# Altium schematic sheet RGBM-04.SchDoc
size Tabloid; SheetNumber: 4; SheetTotal: 7
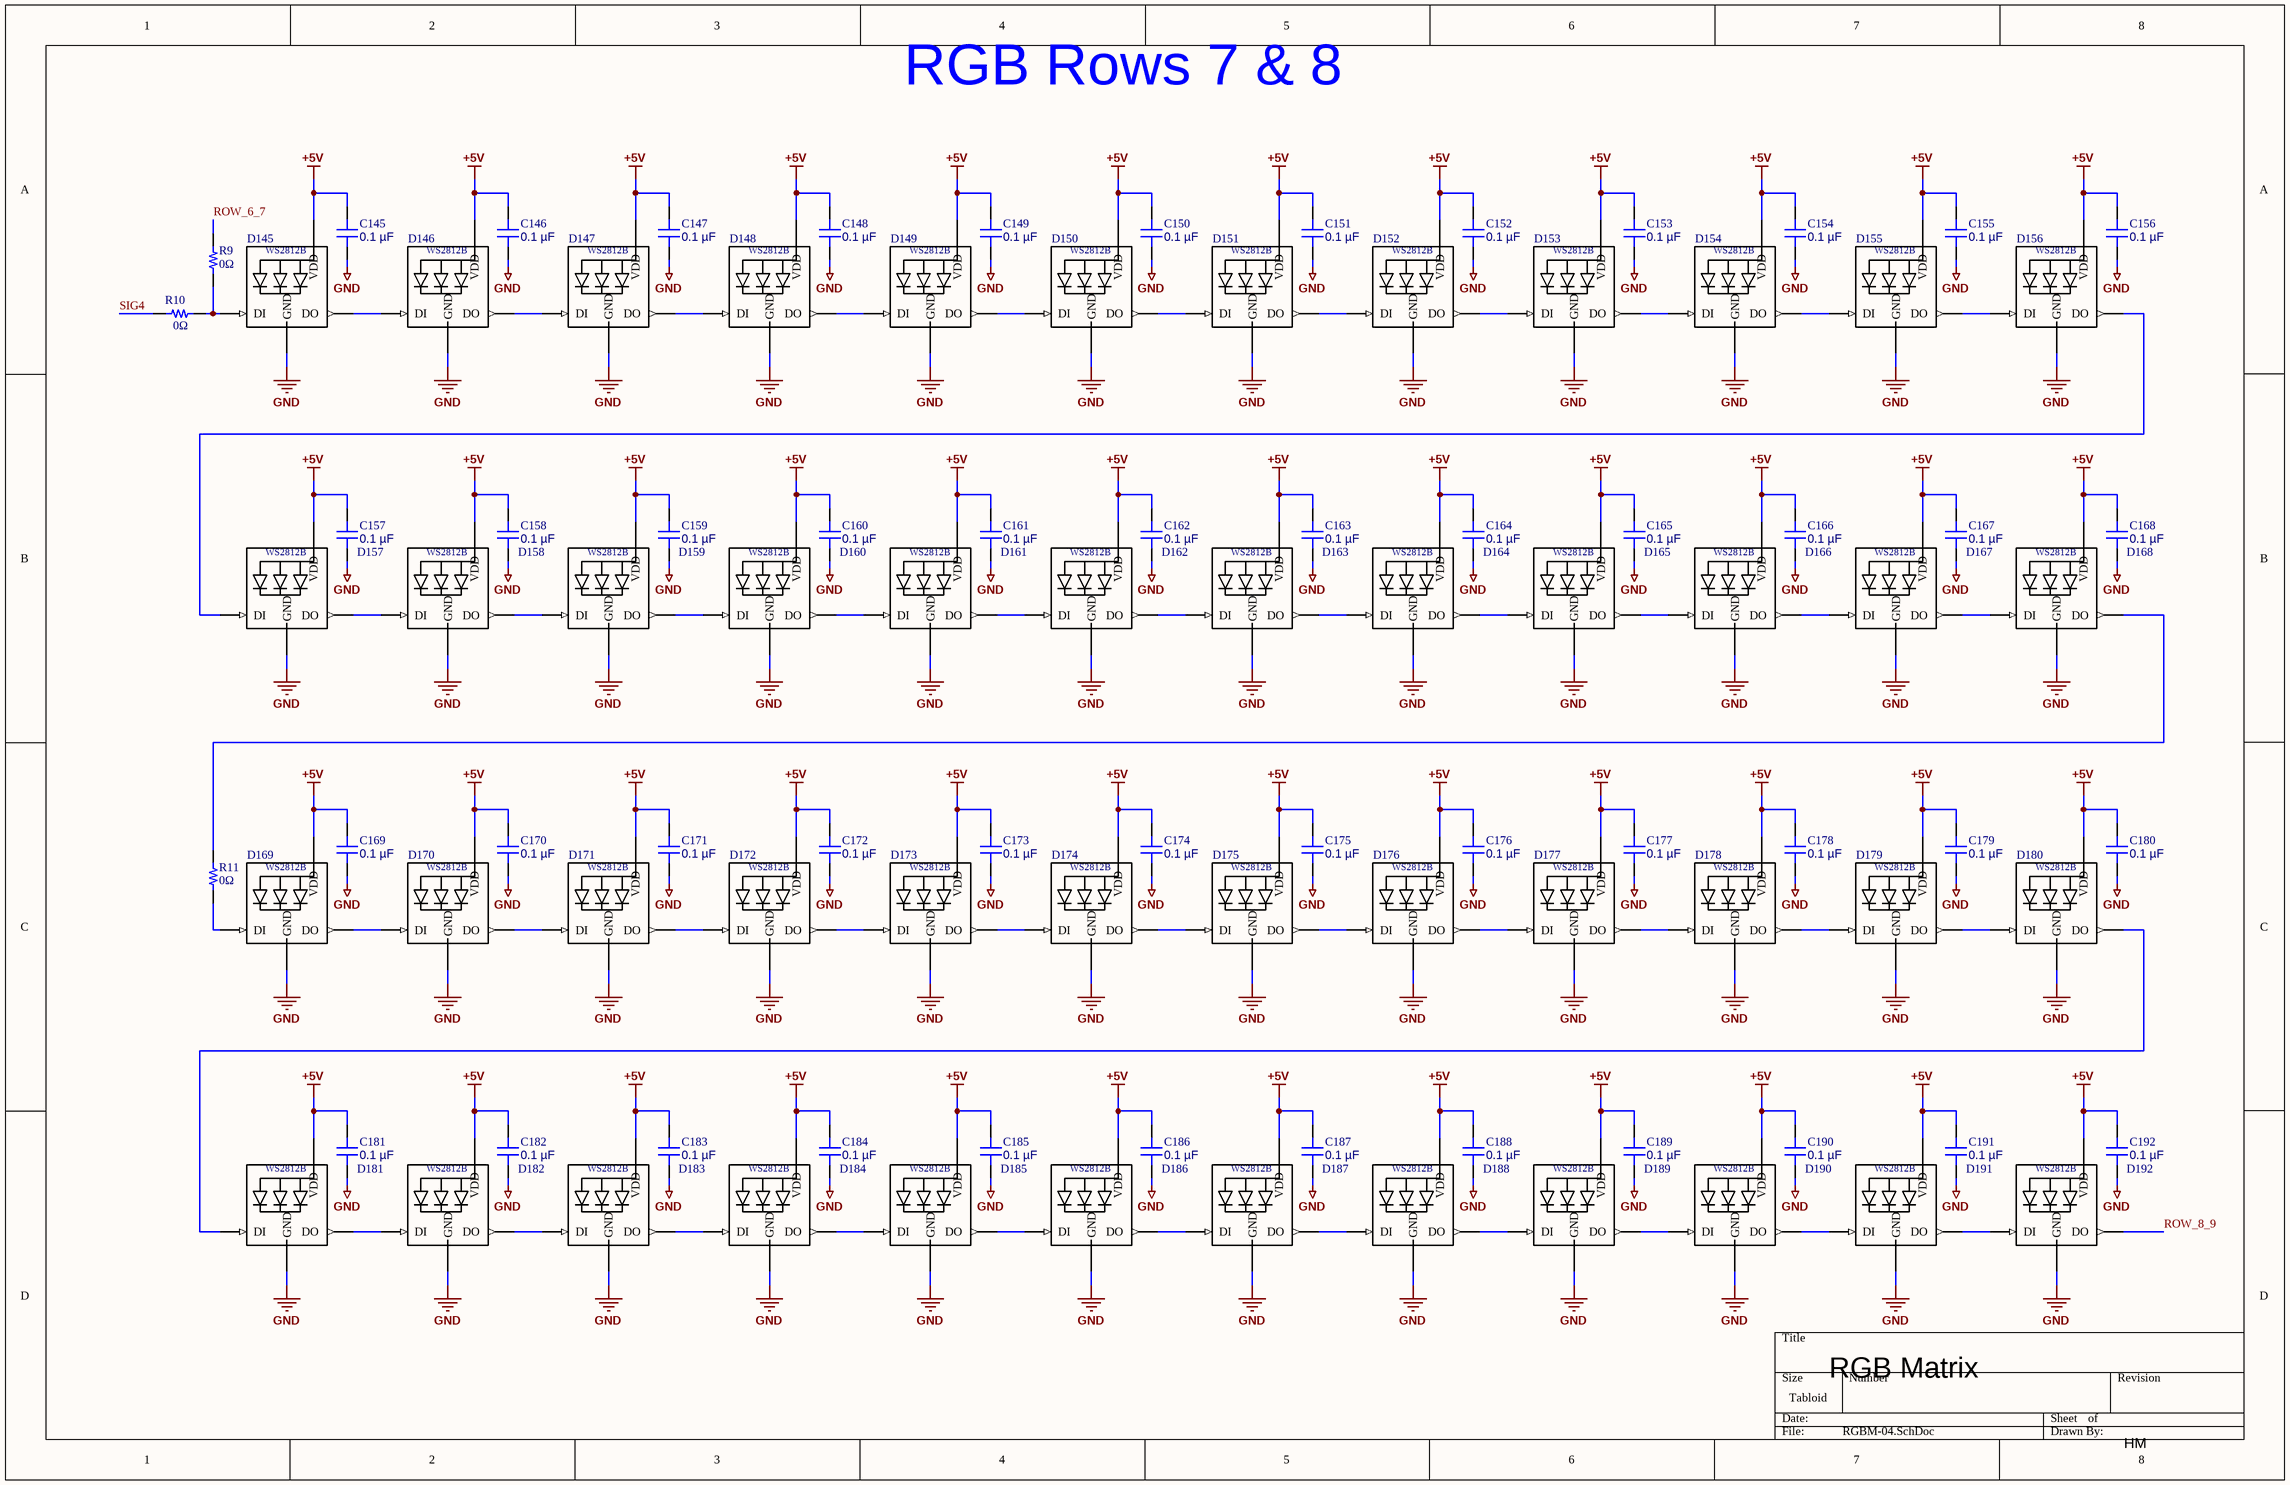
[diagram p0: RGBM-04.SchDoc]

## Parts
C145  0.1 µF  [CAP 0603_1608]
C146  0.1 µF  [CAP 0603_1608]
C147  0.1 µF  [CAP 0603_1608]
C148  0.1 µF  [CAP 0603_1608]
C149  0.1 µF  [CAP 0603_1608]
C150  0.1 µF  [CAP 0603_1608]
C151  0.1 µF  [CAP 0603_1608]
C152  0.1 µF  [CAP 0603_1608]
C153  0.1 µF  [CAP 0603_1608]
C154  0.1 µF  [CAP 0603_1608]
C155  0.1 µF  [CAP 0603_1608]
C156  0.1 µF  [CAP 0603_1608]
C157  0.1 µF  [CAP 0603_1608]
C158  0.1 µF  [CAP 0603_1608]
C159  0.1 µF  [CAP 0603_1608]
C160  0.1 µF  [CAP 0603_1608]
C161  0.1 µF  [CAP 0603_1608]
C162  0.1 µF  [CAP 0603_1608]
C163  0.1 µF  [CAP 0603_1608]
C164  0.1 µF  [CAP 0603_1608]
C165  0.1 µF  [CAP 0603_1608]
C166  0.1 µF  [CAP 0603_1608]
C167  0.1 µF  [CAP 0603_1608]
C168  0.1 µF  [CAP 0603_1608]
C169  0.1 µF  [CAP 0603_1608]
C170  0.1 µF  [CAP 0603_1608]
C171  0.1 µF  [CAP 0603_1608]
C172  0.1 µF  [CAP 0603_1608]
C173  0.1 µF  [CAP 0603_1608]
C174  0.1 µF  [CAP 0603_1608]
C175  0.1 µF  [CAP 0603_1608]
C176  0.1 µF  [CAP 0603_1608]
C177  0.1 µF  [CAP 0603_1608]
C178  0.1 µF  [CAP 0603_1608]
C179  0.1 µF  [CAP 0603_1608]
C180  0.1 µF  [CAP 0603_1608]
C181  0.1 µF  [CAP 0603_1608]
C182  0.1 µF  [CAP 0603_1608]
C183  0.1 µF  [CAP 0603_1608]
C184  0.1 µF  [CAP 0603_1608]
C185  0.1 µF  [CAP 0603_1608]
C186  0.1 µF  [CAP 0603_1608]
C187  0.1 µF  [CAP 0603_1608]
C188  0.1 µF  [CAP 0603_1608]
C189  0.1 µF  [CAP 0603_1608]
C190  0.1 µF  [CAP 0603_1608]
C191  0.1 µF  [CAP 0603_1608]
C192  0.1 µF  [CAP 0603_1608]
D145  WS2812B  [*WS2812B_WS2812B(Primary)]  (value not drawn)
D146  WS2812B  [*WS2812B_WS2812B(Primary)]  (value not drawn)
D147  WS2812B  [*WS2812B_WS2812B(Primary)]  (value not drawn)
D148  WS2812B  [*WS2812B_WS2812B(Primary)]  (value not drawn)
D149  WS2812B  [*WS2812B_WS2812B(Primary)]  (value not drawn)
D150  WS2812B  [*WS2812B_WS2812B(Primary)]  (value not drawn)
D151  WS2812B  [*WS2812B_WS2812B(Primary)]  (value not drawn)
D152  WS2812B  [*WS2812B_WS2812B(Primary)]  (value not drawn)
D153  WS2812B  [*WS2812B_WS2812B(Primary)]  (value not drawn)
D154  WS2812B  [*WS2812B_WS2812B(Primary)]  (value not drawn)
D155  WS2812B  [*WS2812B_WS2812B(Primary)]  (value not drawn)
D156  WS2812B  [*WS2812B_WS2812B(Primary)]  (value not drawn)
D157  WS2812B  [*WS2812B_WS2812B(Primary)]  (value not drawn)
D158  WS2812B  [*WS2812B_WS2812B(Primary)]  (value not drawn)
D159  WS2812B  [*WS2812B_WS2812B(Primary)]  (value not drawn)
D160  WS2812B  [*WS2812B_WS2812B(Primary)]  (value not drawn)
D161  WS2812B  [*WS2812B_WS2812B(Primary)]  (value not drawn)
D162  WS2812B  [*WS2812B_WS2812B(Primary)]  (value not drawn)
D163  WS2812B  [*WS2812B_WS2812B(Primary)]  (value not drawn)
D164  WS2812B  [*WS2812B_WS2812B(Primary)]  (value not drawn)
D165  WS2812B  [*WS2812B_WS2812B(Primary)]  (value not drawn)
D166  WS2812B  [*WS2812B_WS2812B(Primary)]  (value not drawn)
D167  WS2812B  [*WS2812B_WS2812B(Primary)]  (value not drawn)
D168  WS2812B  [*WS2812B_WS2812B(Primary)]  (value not drawn)
D169  WS2812B  [*WS2812B_WS2812B(Primary)]  (value not drawn)
D170  WS2812B  [*WS2812B_WS2812B(Primary)]  (value not drawn)
D171  WS2812B  [*WS2812B_WS2812B(Primary)]  (value not drawn)
D172  WS2812B  [*WS2812B_WS2812B(Primary)]  (value not drawn)
D173  WS2812B  [*WS2812B_WS2812B(Primary)]  (value not drawn)
D174  WS2812B  [*WS2812B_WS2812B(Primary)]  (value not drawn)
D175  WS2812B  [*WS2812B_WS2812B(Primary)]  (value not drawn)
D176  WS2812B  [*WS2812B_WS2812B(Primary)]  (value not drawn)
D177  WS2812B  [*WS2812B_WS2812B(Primary)]  (value not drawn)
D178  WS2812B  [*WS2812B_WS2812B(Primary)]  (value not drawn)
D179  WS2812B  [*WS2812B_WS2812B(Primary)]  (value not drawn)
D180  WS2812B  [*WS2812B_WS2812B(Primary)]  (value not drawn)
D181  WS2812B  [*WS2812B_WS2812B(Primary)]  (value not drawn)
D182  WS2812B  [*WS2812B_WS2812B(Primary)]  (value not drawn)
D183  WS2812B  [*WS2812B_WS2812B(Primary)]  (value not drawn)
D184  WS2812B  [*WS2812B_WS2812B(Primary)]  (value not drawn)
D185  WS2812B  [*WS2812B_WS2812B(Primary)]  (value not drawn)
D186  WS2812B  [*WS2812B_WS2812B(Primary)]  (value not drawn)
D187  WS2812B  [*WS2812B_WS2812B(Primary)]  (value not drawn)
D188  WS2812B  [*WS2812B_WS2812B(Primary)]  (value not drawn)
D189  WS2812B  [*WS2812B_WS2812B(Primary)]  (value not drawn)
D190  WS2812B  [*WS2812B_WS2812B(Primary)]  (value not drawn)
D191  WS2812B  [*WS2812B_WS2812B(Primary)]  (value not drawn)
D192  WS2812B  [*WS2812B_WS2812B(Primary)]  (value not drawn)
R9  0Ω  [RES 0603_1608]
R10  0Ω  [RES 0603_1608]
R11  0Ω  [RES 0603_1608]

## Nets
+5V: C145.2 C146.2 C147.2 C148.2 C149.2 C150.2 C151.2 C152.2 C153.2 C154.2 C155.2 C156.2 C157.2 C158.2 C159.2 C160.2 C161.2 C162.2 C163.2 C164.2 C165.2 C166.2 C167.2 C168.2 C169.2 C170.2 C171.2 C172.2 C173.2 C174.2 C175.2 C176.2 C177.2 C178.2 C179.2 C180.2 C181.2 C182.2 C183.2 C184.2 C185.2 C186.2 C187.2 C188.2 C189.2 C190.2 C191.2 C192.2 D145.1-VDD(VDD) D146.1-VDD(VDD) D147.1-VDD(VDD) D148.1-VDD(VDD) D149.1-VDD(VDD) D150.1-VDD(VDD) D151.1-VDD(VDD) D152.1-VDD(VDD) D153.1-VDD(VDD) D154.1-VDD(VDD) D155.1-VDD(VDD) D156.1-VDD(VDD) D157.1-VDD(VDD) D158.1-VDD(VDD) D159.1-VDD(VDD) D160.1-VDD(VDD) D161.1-VDD(VDD) D162.1-VDD(VDD) D163.1-VDD(VDD) D164.1-VDD(VDD) D165.1-VDD(VDD) D166.1-VDD(VDD) D167.1-VDD(VDD) D168.1-VDD(VDD) D169.1-VDD(VDD) D170.1-VDD(VDD) D171.1-VDD(VDD) D172.1-VDD(VDD) D173.1-VDD(VDD) D174.1-VDD(VDD) D175.1-VDD(VDD) D176.1-VDD(VDD) D177.1-VDD(VDD) D178.1-VDD(VDD) D179.1-VDD(VDD) D180.1-VDD(VDD) D181.1-VDD(VDD) D182.1-VDD(VDD) D183.1-VDD(VDD) D184.1-VDD(VDD) D185.1-VDD(VDD) D186.1-VDD(VDD) D187.1-VDD(VDD) D188.1-VDD(VDD) D189.1-VDD(VDD) D190.1-VDD(VDD) D191.1-VDD(VDD) D192.1-VDD(VDD)
GND: C145.1 C146.1 C147.1 C148.1 C149.1 C150.1 C151.1 C152.1 C153.1 C154.1 C155.1 C156.1 C157.1 C158.1 C159.1 C160.1 C161.1 C162.1 C163.1 C164.1 C165.1 C166.1 C167.1 C168.1 C169.1 C170.1 C171.1 C172.1 C173.1 C174.1 C175.1 C176.1 C177.1 C178.1 C179.1 C180.1 C181.1 C182.1 C183.1 C184.1 C185.1 C186.1 C187.1 C188.1 C189.1 C190.1 C191.1 C192.1 D145.3-GND(GND) D146.3-GND(GND) D147.3-GND(GND) D148.3-GND(GND) D149.3-GND(GND) D150.3-GND(GND) D151.3-GND(GND) D152.3-GND(GND) D153.3-GND(GND) D154.3-GND(GND) D155.3-GND(GND) D156.3-GND(GND) D157.3-GND(GND) D158.3-GND(GND) D159.3-GND(GND) D160.3-GND(GND) D161.3-GND(GND) D162.3-GND(GND) D163.3-GND(GND) D164.3-GND(GND) D165.3-GND(GND) D166.3-GND(GND) D167.3-GND(GND) D168.3-GND(GND) D169.3-GND(GND) D170.3-GND(GND) D171.3-GND(GND) D172.3-GND(GND) D173.3-GND(GND) D174.3-GND(GND) D175.3-GND(GND) D176.3-GND(GND) D177.3-GND(GND) D178.3-GND(GND) D179.3-GND(GND) D180.3-GND(GND) D181.3-GND(GND) D182.3-GND(GND) D183.3-GND(GND) D184.3-GND(GND) D185.3-GND(GND) D186.3-GND(GND) D187.3-GND(GND) D188.3-GND(GND) D189.3-GND(GND) D190.3-GND(GND) D191.3-GND(GND) D192.3-GND(GND)
ROW_6_7: R9.2
ROW_8_9: D192.2-DOUT(DO)
SIG4: R10.1
NetD145_2-DOUT: D145.2-DOUT(DO) D146.4-DIN(DI)
NetD145_4-DIN: D145.4-DIN(DI) R9.1 R10.2
NetD146_2-DOUT: D146.2-DOUT(DO) D147.4-DIN(DI)
NetD147_2-DOUT: D147.2-DOUT(DO) D148.4-DIN(DI)
NetD148_2-DOUT: D148.2-DOUT(DO) D149.4-DIN(DI)
NetD149_2-DOUT: D149.2-DOUT(DO) D150.4-DIN(DI)
NetD150_2-DOUT: D150.2-DOUT(DO) D151.4-DIN(DI)
NetD151_2-DOUT: D151.2-DOUT(DO) D152.4-DIN(DI)
NetD152_2-DOUT: D152.2-DOUT(DO) D153.4-DIN(DI)
NetD153_2-DOUT: D153.2-DOUT(DO) D154.4-DIN(DI)
NetD154_2-DOUT: D154.2-DOUT(DO) D155.4-DIN(DI)
NetD155_2-DOUT: D155.2-DOUT(DO) D156.4-DIN(DI)
NetD156_2-DOUT: D156.2-DOUT(DO) D157.4-DIN(DI)
NetD157_2-DOUT: D157.2-DOUT(DO) D158.4-DIN(DI)
NetD158_2-DOUT: D158.2-DOUT(DO) D159.4-DIN(DI)
NetD159_2-DOUT: D159.2-DOUT(DO) D160.4-DIN(DI)
NetD160_2-DOUT: D160.2-DOUT(DO) D161.4-DIN(DI)
NetD161_2-DOUT: D161.2-DOUT(DO) D162.4-DIN(DI)
NetD162_2-DOUT: D162.2-DOUT(DO) D163.4-DIN(DI)
NetD163_2-DOUT: D163.2-DOUT(DO) D164.4-DIN(DI)
NetD164_2-DOUT: D164.2-DOUT(DO) D165.4-DIN(DI)
NetD165_2-DOUT: D165.2-DOUT(DO) D166.4-DIN(DI)
NetD166_2-DOUT: D166.2-DOUT(DO) D167.4-DIN(DI)
NetD167_2-DOUT: D167.2-DOUT(DO) D168.4-DIN(DI)
NetD168_2-DOUT: D168.2-DOUT(DO) R11.2
NetD169_2-DOUT: D169.2-DOUT(DO) D170.4-DIN(DI)
NetD169_4-DIN: D169.4-DIN(DI) R11.1
NetD170_2-DOUT: D170.2-DOUT(DO) D171.4-DIN(DI)
NetD171_2-DOUT: D171.2-DOUT(DO) D172.4-DIN(DI)
NetD172_2-DOUT: D172.2-DOUT(DO) D173.4-DIN(DI)
NetD173_2-DOUT: D173.2-DOUT(DO) D174.4-DIN(DI)
NetD174_2-DOUT: D174.2-DOUT(DO) D175.4-DIN(DI)
NetD175_2-DOUT: D175.2-DOUT(DO) D176.4-DIN(DI)
NetD176_2-DOUT: D176.2-DOUT(DO) D177.4-DIN(DI)
NetD177_2-DOUT: D177.2-DOUT(DO) D178.4-DIN(DI)
NetD178_2-DOUT: D178.2-DOUT(DO) D179.4-DIN(DI)
NetD179_2-DOUT: D179.2-DOUT(DO) D180.4-DIN(DI)
NetD180_2-DOUT: D180.2-DOUT(DO) D181.4-DIN(DI)
NetD181_2-DOUT: D181.2-DOUT(DO) D182.4-DIN(DI)
NetD182_2-DOUT: D182.2-DOUT(DO) D183.4-DIN(DI)
NetD183_2-DOUT: D183.2-DOUT(DO) D184.4-DIN(DI)
NetD184_2-DOUT: D184.2-DOUT(DO) D185.4-DIN(DI)
NetD185_2-DOUT: D185.2-DOUT(DO) D186.4-DIN(DI)
NetD186_2-DOUT: D186.2-DOUT(DO) D187.4-DIN(DI)
NetD187_2-DOUT: D187.2-DOUT(DO) D188.4-DIN(DI)
NetD188_2-DOUT: D188.2-DOUT(DO) D189.4-DIN(DI)
NetD189_2-DOUT: D189.2-DOUT(DO) D190.4-DIN(DI)
NetD190_2-DOUT: D190.2-DOUT(DO) D191.4-DIN(DI)
NetD191_2-DOUT: D191.2-DOUT(DO) D192.4-DIN(DI)

## Notes on the sheet
- RGB Rows 7 & 8
- RGB Matrix
- HM

## Library data of the parts
C145-C192 = C0603C104K5RAC7411: CAP CER 0.1UF 50V X7R 0603; manufacturer: KEMET; Tolerance: ±10%; Part Number: C0603C104K5RAC7411; Capacitance: 0.1 µF; Applications: Bypass, Decoupling; componentlink1description: Datasheet; componentlink1url: https://api.kemet.com/component-edge/download/datasheet/C0603C104K5RAC7411.pdf; componentlink2description: DigiKey Link; componentlink2url: https://www.digikey.com/en/products/detail/kemet/C0603C104K5RAC7411/3317013; Device Package: 0603 (1608 Metric); lastupdated: 2026-04-06 7:23:52 PM; Lifecycle Status: Active; Minimum Order: 1; Mounting Type: Surface Mount, MLCC; Operating Temperature: -55°C ~ 125°C; Package / Case: 0603 (1608 Metric); packaging: TapeAndReel; partid: 2233; Part Status: Active; price: 0.01; series: SMD Comm X7R; Size / Dimension: 0.063" L x 0.031" W (1.60mm x 0.80mm); Supplier 1: DigiKey; Supplier Part Number 1: 399-C0603C104K5RAC7411CT-ND; Temperature Coefficient: X7R; Thickness (Max): 0.035" (0.90mm); value: 0.1 µF; Voltage - Rated: 50V
D145-D192 = WS2812B: Intelligent control LED integrated light source; MF: Worldsemi; SnapEDA_Link: https://www.snapeda.com/parts/WS2812B/Worldsemi/view-part/?ref=snap; Package: None; MP: WS2812B; Check_prices: https://www.snapeda.com/parts/WS2812B/Worldsemi/view-part/?ref=eda; Value: *
R9-R11 = YJP1608-R001: RES SMD 0 OHM JUMPER 0603; Manufacturer: Susumu; Value: 0 Ohms; Part Number: YJP1608-R001; ComponentLink1Description: Datasheet; ComponentLink1URL: http://www.susumu.co.jp/common/pdf/n_catalog_partition10_en.pdf; ComponentLink2Description: DigiKey Link; ComponentLink2URL: https://www.digikey.com/en/products/detail/susumu/YJP1608-R001/2815047; Composition: Thin Film; Device Package: 0603 (1608 Metric); Height - Seated (Max): 0.016" (0.40mm); LastUpdated: 2024-02-09 8:42:50 PM; Lifecycle Status: Active; Minimum Order: 1; Number of Terminations: 2; Operating Temperature: -40°C ~ 125°C; Package / Case: 0603 (1608 Metric); Packaging: TapeAndReel; PartId: 16802; Part Status: Active; Price: 0.08; Resistance: 0 Ohms; Series: YJP; Size / Dimension: 0.063" L x 0.031" W (1.60mm x 0.80mm); Supplier 1: DigiKey; Supplier Part Number 1: 408-1515-1-ND; Supplier Device Package: 0603; Tolerance: Jumper